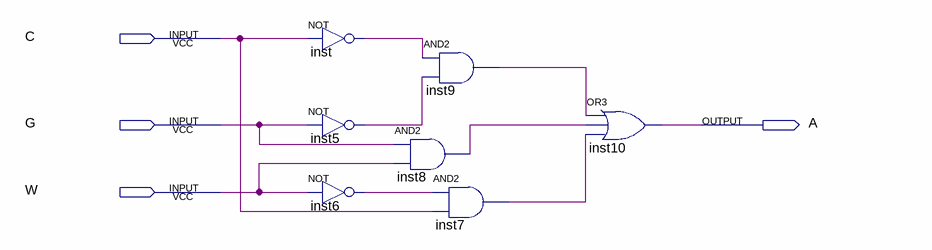
[diagram p0: schematic sheet]
// Quartus schematic lab2step2.bdf as structural Verilog: 7 symbols, 4 pins
module lab2step2 (
  input  C,
  input  G,
  input  W,
  output A
);

  wire inst5_out, inst6_out, inst7_out, inst8_out, inst9_out, inst_out;

  not inst (inst_out, C);
  not inst5 (inst5_out, G);
  not inst6 (inst6_out, W);
  and inst9 (inst9_out, inst_out, inst5_out);
  and inst8 (inst8_out, G, W);
  and inst7 (inst7_out, inst6_out, C);
  or inst10 (A, inst9_out, inst8_out, inst7_out);
endmodule
